# Altium schematic sheet MainSchPBv2.SchDoc: Power Control Unit (PCU)
size Letter; Author: Afshin Kashani Ilkhechi; DrawnBy: AKI; Engineer: AKI; Organization: AKI; DocumentNumber: 1; SheetNumber: 1; SheetTotal: 7
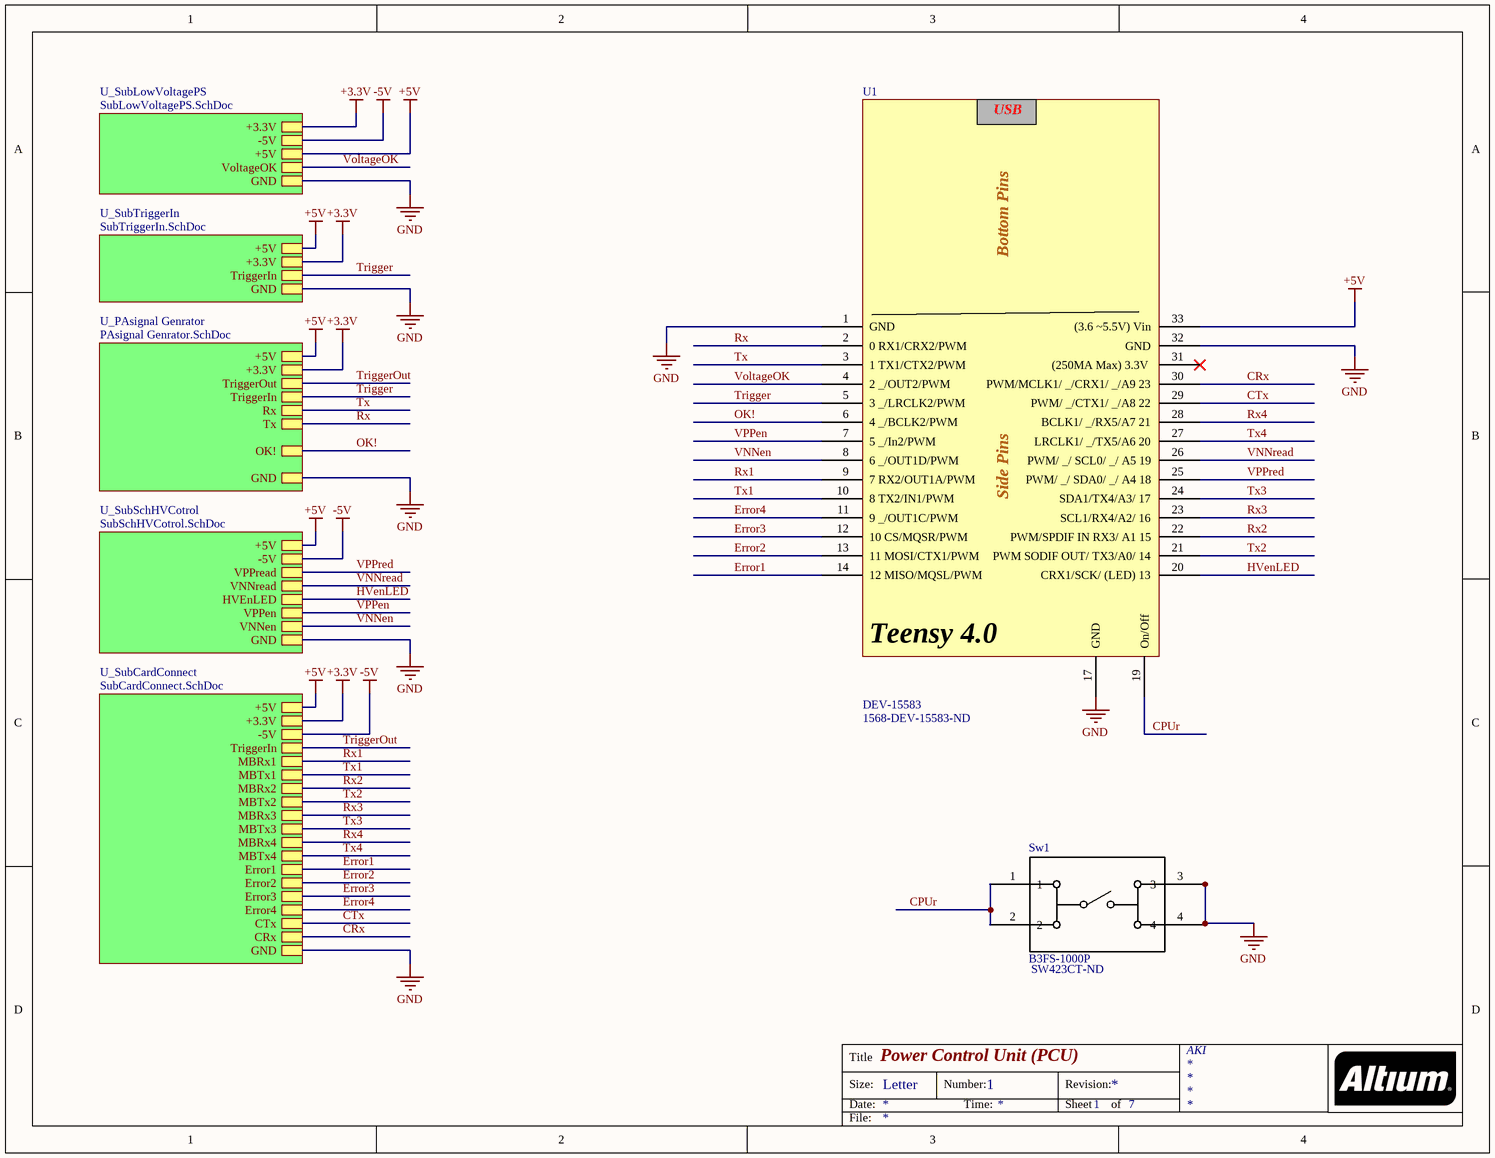
[diagram p0: MainSchPBv2.SchDoc]

## Parts
Sw1  B3FS-1000P  Supplier Part Number 1: SW423CT-ND  [B3FS-1000P]
U1  DEV-15583  Supplier Part Number 1: 1568-DEV-15583-ND  [Teensy 4.0sideOnly]

## Sub-sheets
U_PAsignal Genrator = PAsignal Genrator.SchDoc: TriggerOut, +5V, GND, TriggerIn, Rx, Tx, OK!, +3.3V
U_SubCardConnect = SubCardConnect.SchDoc: +5V, -5V, GND, TriggerIn, +3.3V, MBRx1, MBRx2, MBRx3, MBRx4, MBTx1, MBTx2, MBTx3, MBTx4, Error1, Error2, Error3, Error4, CTx, CRx
U_SubLowVoltagePS = SubLowVoltagePS.SchDoc: +3.3V, -5V, +5V, GND, VoltageOK
U_SubSchHVCotrol = SubSchHVCotrol.SchDoc: +5V, -5V, GND, VPPread, VNNread, VPPen, VNNen, HVEnLED
U_SubTriggerIn = SubTriggerIn.SchDoc: +5V, GND, +3.3V, TriggerIn

## Nets
+3.3V: sheet U_SubCardConnect/+3.3V, sheet U_SubLowVoltagePS/+3.3V, sheet U_SubTriggerIn/+3.3V, sheet U_PAsignal Genrator/+3.3V
+5V: U1.33((3.6_~5.5V)_Vin) ; sheet U_SubCardConnect/+5V, sheet U_SubSchHVCotrol/+5V, sheet U_SubLowVoltagePS/+5V, sheet U_SubTriggerIn/+5V, sheet U_PAsignal Genrator/+5V
-5V: sheet U_SubCardConnect/-5V, sheet U_SubSchHVCotrol/-5V, sheet U_SubLowVoltagePS/-5V
GND: Sw1.3 Sw1.4 U1.1(GND) U1.17(GND) U1.32(GND) ; sheet U_SubCardConnect/GND, sheet U_SubSchHVCotrol/GND, sheet U_SubLowVoltagePS/GND, sheet U_SubTriggerIn/GND, sheet U_PAsignal Genrator/GND
CPUr: Sw1.1 Sw1.2 U1.19(On/Off)
CRx: U1.30(PWM/MCLK1/__/CRX1/__/A9_23) ; sheet U_SubCardConnect/CRx
CTx: U1.29(PWM/__/CTX1/__/A8_22) ; sheet U_SubCardConnect/CTx
Error1: U1.14(12_MISO/MQSL/PWM) ; sheet U_SubCardConnect/Error1
Error2: U1.13(11_MOSI/CTX1/PWM) ; sheet U_SubCardConnect/Error2
Error3: U1.12(10_CS/MQSR/PWM) ; sheet U_SubCardConnect/Error3
Error4: U1.11(9__/OUT1C/PWM) ; sheet U_SubCardConnect/Error4
HVenLED: U1.20(CRX1/SCK/_(LED)_13) ; sheet U_SubSchHVCotrol/HVEnLED
OK!: U1.6(4__/BCLK2/PWM) ; sheet U_PAsignal Genrator/OK!
Rx: U1.2(0_RX1/CRX2/PWM) ; sheet U_PAsignal Genrator/Tx
Rx1: U1.9(7_RX2/OUT1A/PWM) ; sheet U_SubCardConnect/MBRx1
Rx2: U1.22(PWM/SPDIF_IN_RX3/_A1_15) ; sheet U_SubCardConnect/MBRx2
Rx3: U1.23(SCL1/RX4/A2/_16) ; sheet U_SubCardConnect/MBRx3
Rx4: U1.28(BCLK1/__/RX5/A7_21) ; sheet U_SubCardConnect/MBRx4
Trigger: U1.5(3__/LRCLK2/PWM) ; sheet U_SubTriggerIn/TriggerIn, sheet U_PAsignal Genrator/TriggerIn
TriggerOut: sheet U_SubCardConnect/TriggerIn, sheet U_PAsignal Genrator/TriggerOut
Tx: U1.3(1_TX1/CTX2/PWM) ; sheet U_PAsignal Genrator/Rx
Tx1: U1.10(8_TX2/IN1/PWM) ; sheet U_SubCardConnect/MBTx1
Tx2: U1.21(PWM_SODIF_OUT/_TX3/A0/_14) ; sheet U_SubCardConnect/MBTx2
Tx3: U1.24(SDA1/TX4/A3/_17) ; sheet U_SubCardConnect/MBTx3
Tx4: U1.27(LRCLK1/__/TX5/A6_20) ; sheet U_SubCardConnect/MBTx4
VNNen: U1.8(6__/OUT1D/PWM) ; sheet U_SubSchHVCotrol/VNNen
VNNread: U1.26(PWM/__/_SCL0/__/_A5_19) ; sheet U_SubSchHVCotrol/VNNread
VoltageOK: U1.4(2__/OUT2/PWM) ; sheet U_SubLowVoltagePS/VoltageOK
VPPen: U1.7(5__/In2/PWM) ; sheet U_SubSchHVCotrol/VPPen
VPPred: U1.25(PWM/__/_SDA0/__/_A4_18) ; sheet U_SubSchHVCotrol/VPPread

Not connected (* = marked no-connect by the designer): U1 31((250MA_Max)_3.3V_)*

## Notes on the sheet
- Title
- Size:
- Date:
- Letter
- Number:
- Time:
- Revision:
- Sheet
- of
- File:
- (in symbol Teensy 4.0_SideOnly) USB; Bottom Pins; Side Pins; Teensy 4.0

## Library data of the parts
Sw1 = B3FS-1000P: Tactile Switch SPST-NO Top Actuated Surface Mount; Supplier 1: Digi-Key
U1 = Teensy 4.0_SideOnly: Supplier 1: Digi-Key